# EAGLE schematic LCD_Disp_AIR (EAGLE 6.5.0)
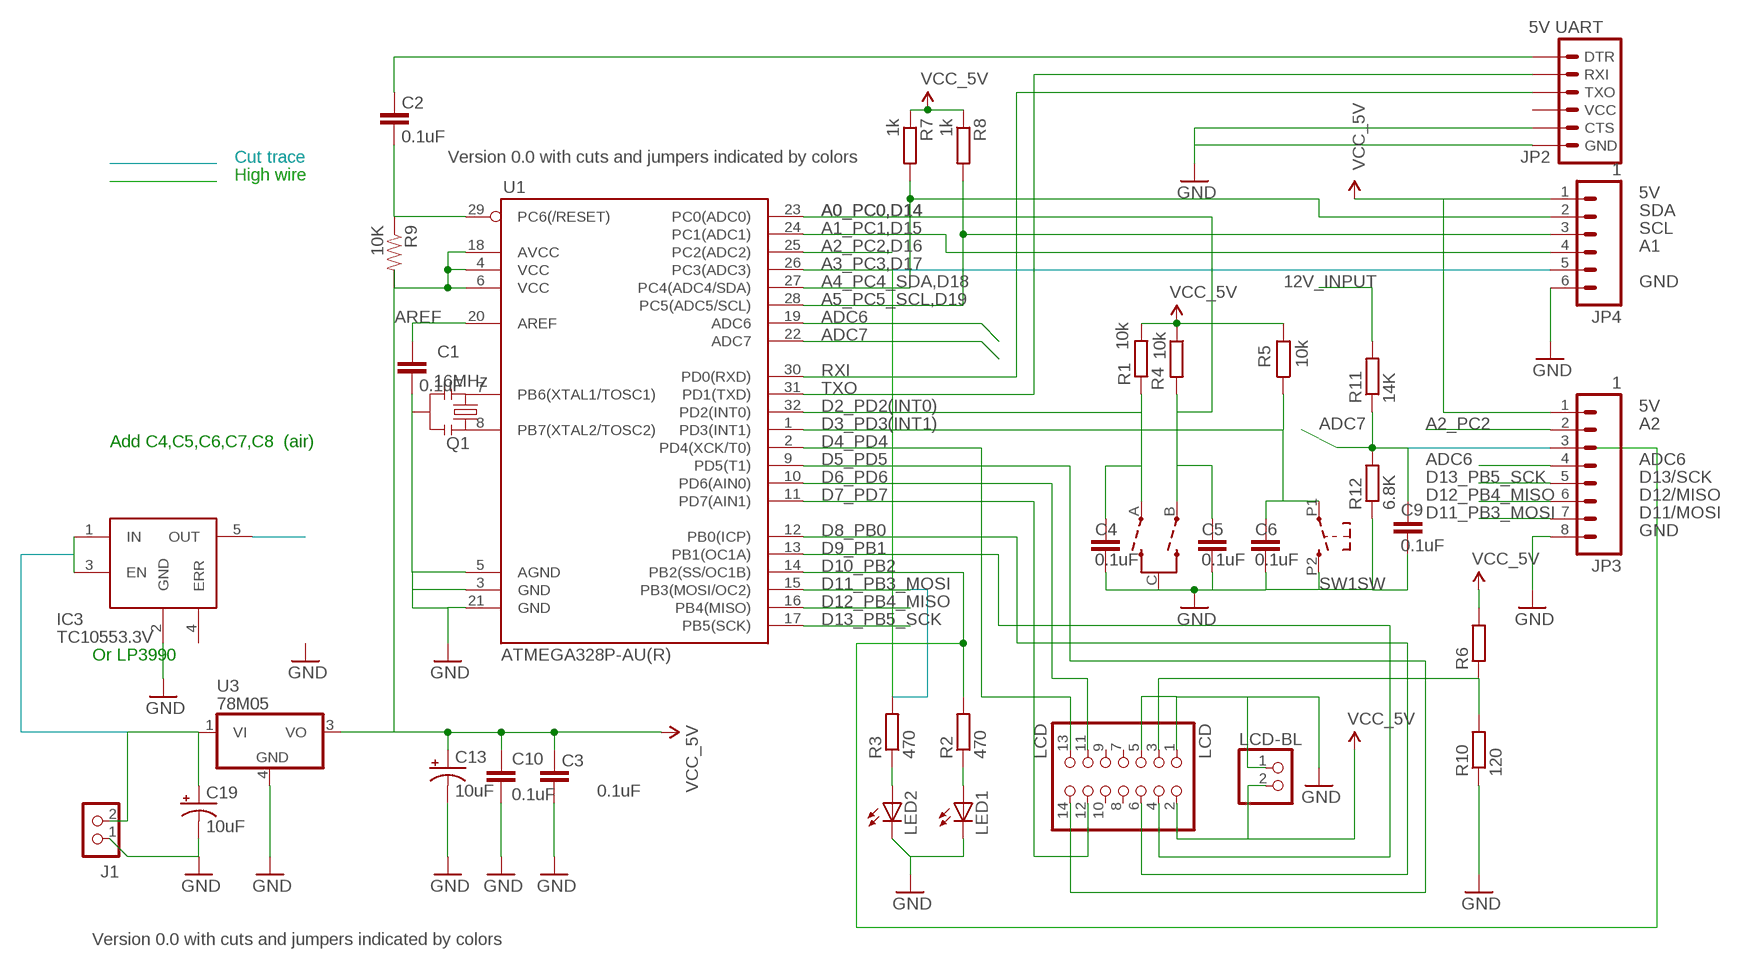
[diagram p0: schematic, sheet 1]

## Parts
C1  0.1uF  CAP0805  [0805]
C2  0.1uF  CAP0805  [0805]
C3  0.1uF  CAP0805  [0805]
C4  0.1uF  CAP0805  [0805]
C5  0.1uF  CAP0805  [0805]
C6  0.1uF  CAP0805  [0805]
C9  0.1uF  CAP0805  [0805]
C10  0.1uF  CAP0805  [0805]
C13  10uF  CAP_POL1206  [EIA3216]
C19  10uF  CAP_POL7343  [EIA7343]
IC3  TC10553.3V  [SOT23-5]
J1  12V input  CON_HEADER_1X02-PTH  [M1X2]
JP2  5V UART  ARDUINO_SERIAL_PROGRAMPTH  [1X06]
JP3  1  M081X08  [1X08]
JP4  1  M06SIP  [1X06]
LCD  LCD  PINHD-2X7  [2X07]
LCD-BL  PINHD-1X2  [1X02]
LED1  LED-5MM  [LED-5MM]
LED2  LED-5MM  [LED-5MM]
Q1  16MHz  RESONATORSMD  [RESONATOR-SMD]
R1  10k  RESISTOR-0603  [R603]
R2  470  RESISTOR-0603  [R603]
R3  470  RESISTOR-0603  [R603]
R4  10k  RESISTOR-0603  [R603]
R5  10k  RESISTOR-0603  [R603]
R6  RESISTOR-0603  [R603]
R7  1k  RESISTOR-0603  [R603]
R8  1k  RESISTOR-0603  [R603]
R9  10K  RESISTOR0603  [0603]
R10  120  RESISTOR-0603  [R603]
R11  14K  RESISTOR-0603  [R603]
R12  6.8K  RESISTOR-0603  [R603]
SW1  ENCODER_SW1-PEC12  [PEC12_INCREMENTAL_ENCODER]
U1  ATMEGA328P-AU(R)  ATMEGA168  [TQFP32-08]
U3  78M05  78MXXL  [DPACK]

## Nets
5V: C3.2 C10.1 C13.A(+) JP3.1 JP4.1 LCD-BL.2 LCD.2 R1.2 R4.1 R5.2 R6.2 R7.1 R8.1 R9.2 U1.4(VCC) U1.6(VCC) U1.18(AVCC) U3.3(VO) ; supply symbol labelled VCC_5V
12V_INPUT: C19.A(+) J1.2 R11.2 U3.1(VI)
A0_PC0,D14: C5.2 R4.2 SW1.B(ENCODER:B) U1.23(PC0(ADC0))
A1_PC1,D15: JP4.4 U1.24(PC1(ADC1))
A2_PC2: JP3.2
A2_PC2,D16: U1.25(PC2(ADC2))
A3_PC3,D17: U1.26(PC3(ADC3))
A4_PC4_SDA,D18: JP4.2 R7.2 U1.27(PC4(ADC4/SDA))
A5_PC5_SCL,D19: JP4.3 R8.2 U1.28(PC5(ADC5/SCL))
ADC6: JP3.4 U1.19(ADC6)
ADC7: C9.1 R11.1 R12.2 U1.22(ADC7)
AREF: C1.2 U1.20(AREF)
D2_PD2(INT0): C4.2 R1.1 SW1.A(ENCODER:A) U1.32(PD2(INT0))
D3_PD3(INT1): C6.2 R5.1 SW1.P1 U1.1(PD3(INT1))
D4_PD4: LCD.13 U1.2(PD4(XCK/T0))
D5_PD5: LCD.14 U1.9(PD5(T1))
D6_PD6: LCD.11 U1.10(PD6(AIN0))
D7_PD7: LCD.12 U1.11(PD7(AIN1))
D8_PB0: LCD.6 U1.12(PB0(ICP))
D9_PB1: LCD.4 U1.13(PB1(OC1A))
D10_PB2: R2.2 U1.14(PB2(SS/OC1B))
D11_PB3_MOSI: JP3.7 U1.15(PB3(MOSI/OC2))
D12_PB4_MISO: JP3.6 U1.16(PB4(MISO))
D13_PB5_SCK: JP3.5 U1.17(PB5(SCK))
GND: C1.1 C3.1 C4.1 C5.1 C6.1 C9.2 C10.2 C13.C(-) C19.C(-) IC3.2(GND) J1.1 JP2.5(CTS) JP2.6(GND) JP3.8 JP4.6 LCD-BL.1 LCD.1 LCD.5 LED1.K(C) LED2.K(C) Q1.2 R10.1 R12.1 SW1.C(ENCODER:C) SW1.P2 U1.3(GND) U1.5(AGND) U1.21(GND) U3.4(GND)
N$2: LCD.3 R6.1 R10.2
N$5: Q1.1 U1.8(PB7(XTAL2/TOSC2))
N$6: C2.2 JP2.1(DTR)
N$9: Q1.3 U1.7(PB6(XTAL1/TOSC1))
N$12: IC3.1(IN) IC3.3(EN)
N$13: LED1.A R2.1
N$15: LED2.A R3.1
RESET: C2.1 R9.1 U1.29(PC6(/RESET))
RXI: JP2.3(TXO) U1.30(PD0(RXD))
TXO: JP2.2(RXI) U1.31(PD1(TXD))
Unconnected: IC3.4(ERR) JP2.4(VCC) JP3.3 JP4.5 LCD.7 LCD.8 LCD.9 LCD.10 R3.2

## Notes on the sheet
- Cut trace | Version 0.0 with cuts and jumpers indicated by colors
- High wire
- 5V
- SDA
- SCL
- A1
- GND
- 5V
- A2
- Add C4,C5,C6,C7,C8  (air)
- ADC6
- D13/SCK
- D12/MISO
- D11/MOSI
- GND
- Or LP3990
- Version 0.0 with cuts and jumpers indicated by colors

## Power pins joined to a net without a drawn wire
OUT: IC3.5(OUT)

## Library data of the parts
C1-C6 C9 C10 = SparkFun:CAP: Capacitor Standard 0603 ceramic capacitor, and 0.1" leaded capacitor.
C13 C19 = SparkFun:CAP_POL: Capacitor Polarized These are standard SMD and PTH capacitors. Normally 10uF, 47uF, and 100uF in electrolytic and tantalum varieties. Always verify the external diameter of the through hole cap, it varies with capacity, voltage, and manufacturer. The EIA devices should be standard.
IC3 = 1AA_Stofer:TC10553.3V
J1 = dp_devices:CON_HEADER_1X02
JP2 = SparkFun:ARDUINO_SERIAL_PROGRAM
JP3 = SparkFun-Connectors:M08: Header 8 Standard 8-pin 0.1" header. Use with straight break away headers (SKU : PRT-00116), right angle break away headers (PRT-00553), swiss pins (PRT-00743), machine pins (PRT-00117), and female headers (PRT-00115).
JP4 = SparkFun-Connectors:M06: Header 6 Standard 6-pin 0.1" header. Use with straight break away headers (SKU : PRT-00116), right angle break away headers (PRT-00553), swiss pins (PRT-00743), machine pins (PRT-00117), and female headers (PRT-00115). Molex polarized connector foot print use with SKU : PRT-08094 with associated crimp pins and housings. NOTES ON THE VARIANTS LOCK and LOCK_LONGPADS... This footprint was designed to help hold the alignment of a through-hole component (i.e. 6-pin header) while soldering it into place. You may notice that each hole has been shifted either up or down by 0.005 of an inch from it's more standard position (which is a perfectly straight line). This slight alteration caused the pins (the squares in the middle) to touch the edges of the holes. Because they are alternating, it causes a "brace" to hold the component in place. 0.005 has proven to be the perfect amount of "off-center" position when using our standard breakaway headers. Although looks a little odd when you look at the bare footprint, once you have a header in there, the alteration is very hard to notice. Also, if you push a header all the way into place, it is covered up entirely on the bottom side. This idea of altering the position of holes to aid alignment will be further integrated into the Sparkfun Library for other footprints. It can help hold any component with 3 or more connection pins.
LCD = pinhead:PINHD-2X7: PIN HEADER
LCD-BL = 1AA_Stofer:PINHD-1X2: PIN HEADER
LED1 LED2 = dp_devices:LED: Light Emitting Diode
Q1 = SparkFun:RESONATOR: Resonator Small SMD resonator. This is the itty bitty 10/20MHz resonators with built in caps. CSTCE10M0G55 and CSTCE20M0V53. Footprint has been reviewed closely but hasn't been tested yet.
R1-R8 R10-R12 = dp_devices:RESISTOR
R9 = SparkFun:RESISTOR: Resistor Basic schematic elements and footprints for 0603, 1206, and PTH 1/10th watt (small) resistors.
SW1 = dp_devices:ENCODER_SW1: Incremental Encoder with push switch
U1 = SparkFun:ATMEGA168
U3 = wifi_WX:78MXXL: VOLTAGE REGULATOR

## Net classes
1 vcc: width 0.254 mm